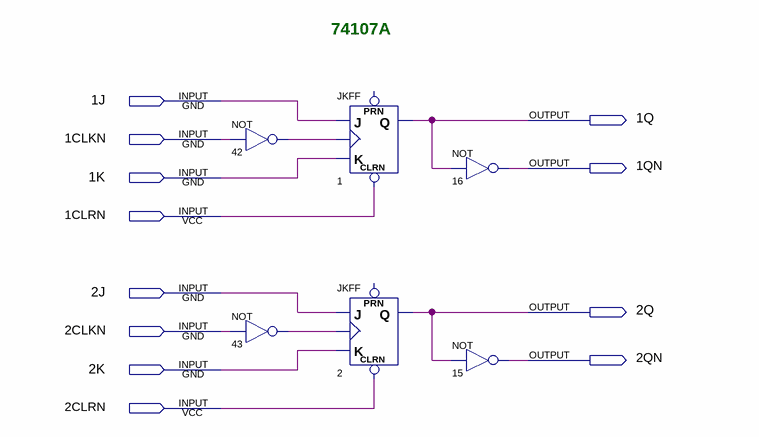
[diagram p0: schematic sheet]
// Quartus schematic 74107a.bdf as structural Verilog: 6 symbols, 12 pins
module \74107a  (
  input  \1J ,
  input  \1CLKN ,
  input  \1K ,
  input  \1CLRN ,
  input  \2J ,
  input  \2CLKN ,
  input  \2K ,
  input  \2CLRN ,
  output \1Q ,
  output \1QN ,
  output \2Q ,
  output \2QN 
);

  wire n42_out, n43_out;

  not u_42 (n42_out, \1CLKN );
  not u_43 (n43_out, \2CLKN );
  JKFF u_1 (.CLRN(\1CLRN ), .K(\1K ), .J(\1J ), .CLK(n42_out), .Q(\1Q ));  // open: PRN
  JKFF u_2 (.CLRN(\2CLRN ), .K(\2K ), .J(\2J ), .CLK(n43_out), .Q(\2Q ));  // open: PRN
  not u_16 (\1QN , \1Q );
  not u_15 (\2QN , \2Q );

  // Notes on the sheet:
  //   74107A
endmodule
